# EAGLE schematic zumy_carrier_board_rev1 (EAGLE 8.2.2)
AUTHOR: A.Pullin / A.J.Chen / A.D.Buchan; REVISION: F; YEAR: 2015
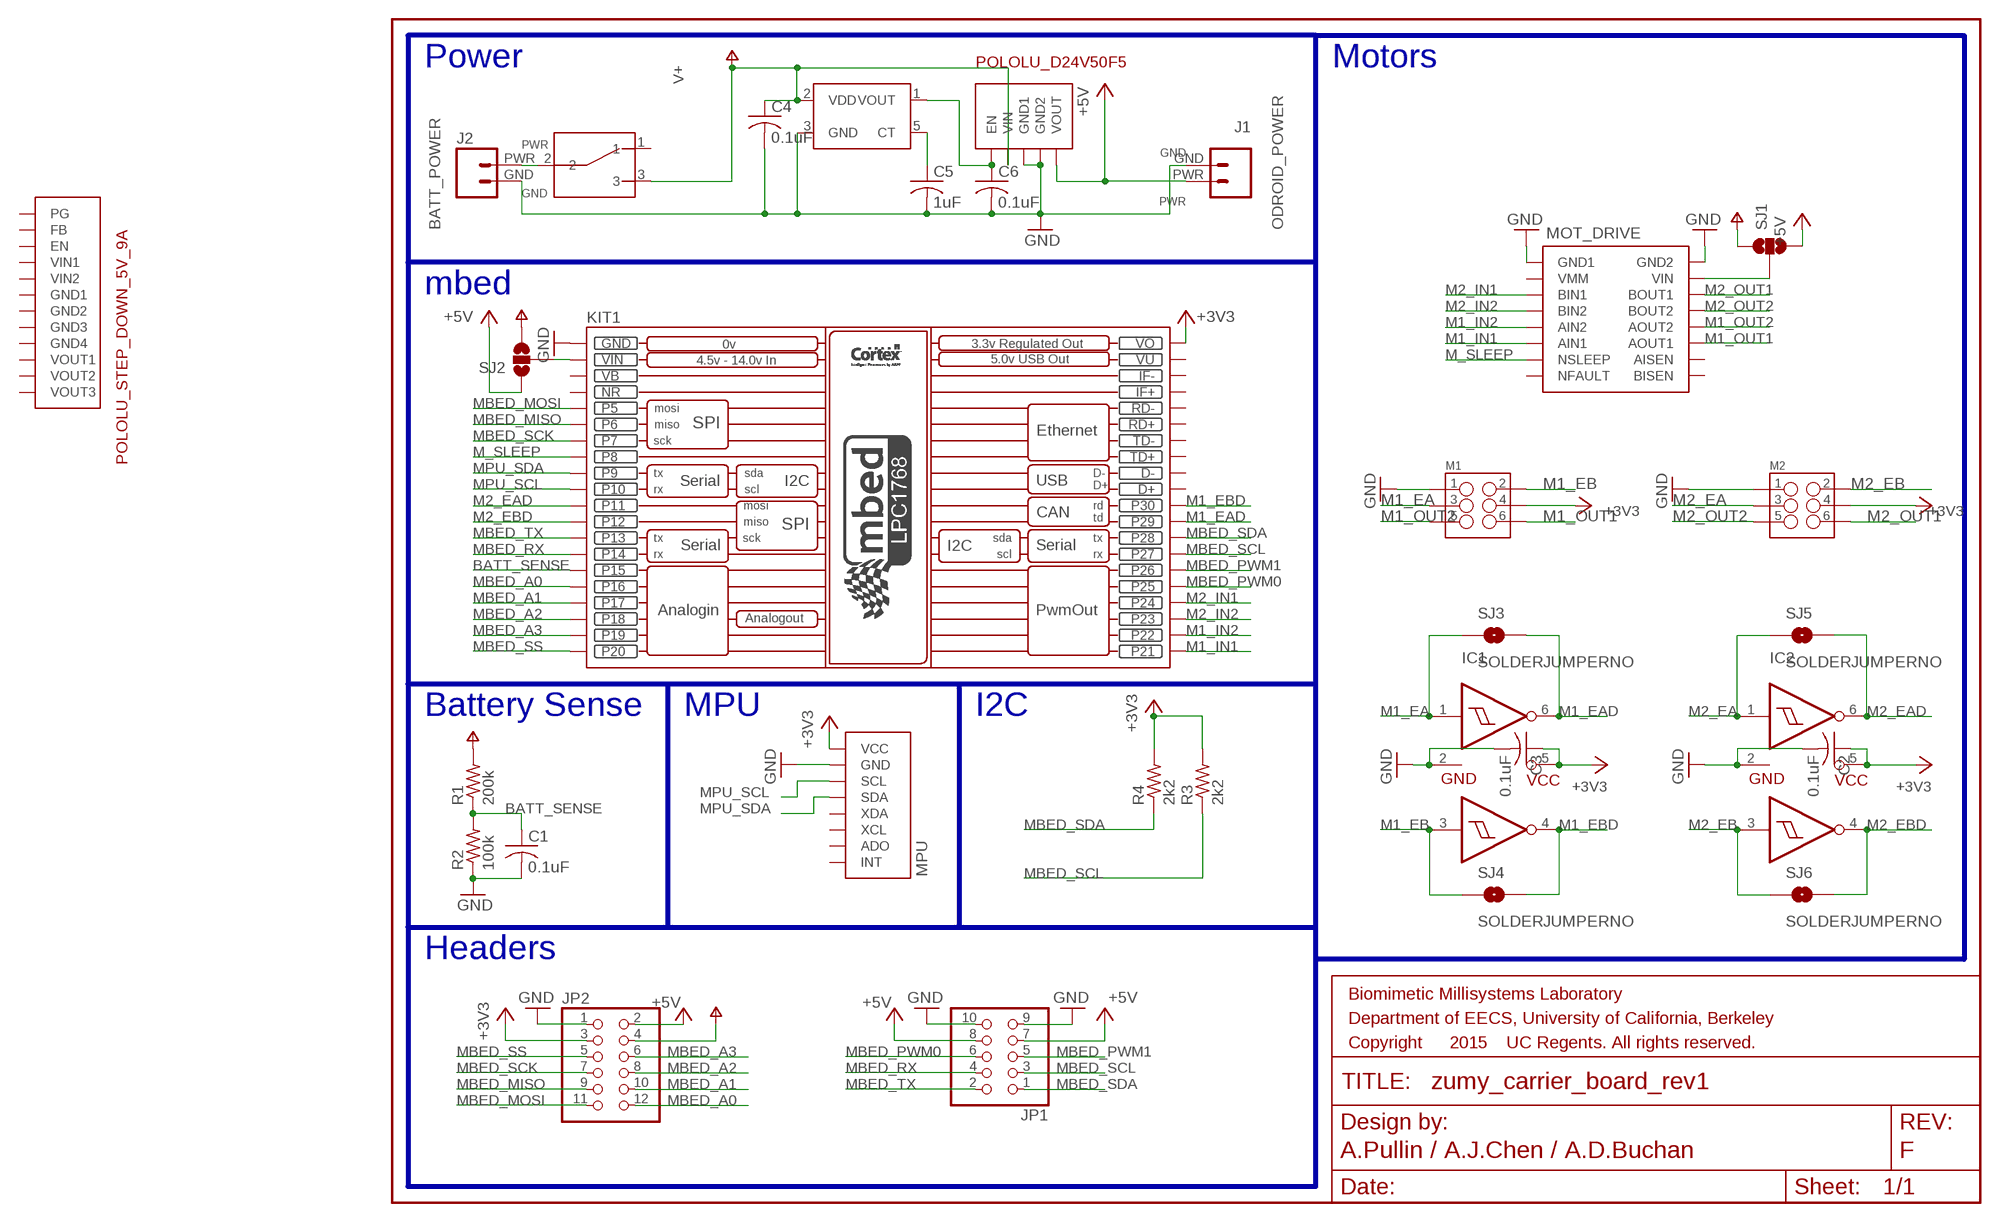
[diagram p0: schematic, sheet 1]

## Parts
C1  0.1uF  C-USC1206  [C1206]
C2  0.1uF  C-USC1206  [C1206]
C3  0.1uF  C-USC1206  [C1206]
C4  0.1uF  C-USC1206  [C1206]
C5  1uF  C-USC1206  [C1206]
C6  0.1uF  C-USC1206  [C1206]
IC1  SN74AUP2G17  [SC-70-6]
IC2  SN74AUP2G17  [SC-70-6]
J1  ODROID_POWER  [ODOIRD_PWR]
J2  BATT_POWER  [BATT_POWER]
JP1  PINHD-2X5  [2X05]
JP2  PINHD-2X6  [2X06]
KIT1  MBED_NXP_LPC1768  [MBED-KIT]
M1  M03X2SHROUD  [2X3-SHROUDED]
M2  M03X2SHROUD  [2X3-SHROUDED]
MOT_DRIVE  POLOLU_DRV8833_MODULE  [POLOLU_DRV8833_MODULE]
MPU  ITG/MPU_MODULE  [ITG/MPU_MODULE]
R1  200k  R-US_R1206  [R1206]
R2  100k  R-US_R1206  [R1206]
R3  2k2  R-US_R1206  [R1206]
R4  2k2  R-US_R1206  [R1206]
SJ1  SOLDERJUMPER_2WAYT  [SJ_2]
SJ2  SOLDERJUMPER_2WAYT  [SJ_2]
SJ3  SOLDERJUMPERNO  [SJ_2S-NO]
SJ4  SOLDERJUMPERNO  [SJ_2S-NO]
SJ5  SOLDERJUMPERNO  [SJ_2S-NO]
SJ6  SOLDERJUMPERNO  [SJ_2S-NO]
SW1  500SSP1S1M6QEA  [500SSP1S1M6QEA_SWITCH]
U$2  BD5260G  [SOT23-5]
U$3  POLOLU_STEP_DOWN_5V_9A  [POLOLU_STEP_DOWN_5V_9A]
U$5  POLOLU_D24V50F5  [POLOLU_D24V50F5]

## Nets
+3V3: C2.1 C3.1 IC1.5(VCC) IC2.5(VCC) JP2.3 KIT1.VOUT(VO) M1.4 M2.4 MPU.VCC R3.2 R4.2
+5V: J1.PWR JP1.7 JP1.8 JP2.2 SJ1.3 SJ2.1 U$5.VOUT
BATT_SENSE: C1.1 KIT1.P$15(P15) R1.1 R2.2
GND: C1.2 C2.2 C3.2 C4.2 C5.2 C6.2 IC1.2(GND) IC2.2(GND) J1.GND J2.GND JP1.9 JP1.10 JP2.1 KIT1.GND M1.1 M2.1 MOT_DRIVE.GND1 MOT_DRIVE.GND2 MPU.GND R2.1 U$2.3(GND) U$5.GND1 U$5.GND2
M1_EA: IC1.1(1A) M1.3 SJ3.1
M1_EAD: IC1.6(1Y) KIT1.P$29(P29) SJ3.2
M1_EB: IC1.3(2A) M1.2 SJ4.1
M1_EBD: IC1.4(2Y) KIT1.P$30(P30) SJ4.2
M1_IN1: KIT1.P$21(P21) MOT_DRIVE.AIN1
M1_IN2: KIT1.P$22(P22) MOT_DRIVE.AIN2
M1_OUT1: M1.6 MOT_DRIVE.AOUT1
M1_OUT2: M1.5 MOT_DRIVE.AOUT2
M2_EA: IC2.1(1A) M2.3 SJ5.1
M2_EAD: IC2.6(1Y) KIT1.P$11(P11) SJ5.2
M2_EB: IC2.3(2A) M2.2 SJ6.1
M2_EBD: IC2.4(2Y) KIT1.P$12(P12) SJ6.2
M2_IN1: KIT1.P$24(P24) MOT_DRIVE.BIN1
M2_IN2: KIT1.P$23(P23) MOT_DRIVE.BIN2
M2_OUT1: M2.6 MOT_DRIVE.BOUT1
M2_OUT2: M2.5 MOT_DRIVE.BOUT2
M_SLEEP: KIT1.P$8(P8) MOT_DRIVE.NSLEEP
MBED_A0: JP2.12 KIT1.P$16(P16)
MBED_A1: JP2.10 KIT1.P$17(P17)
MBED_A2: JP2.8 KIT1.P$18(P18)
MBED_A3: JP2.6 KIT1.P$19(P19)
MBED_MISO: JP2.9 KIT1.P$6(P6)
MBED_MOSI: JP2.11 KIT1.P$5(P5)
MBED_PWM0: JP1.6 KIT1.P$25(P25)
MBED_PWM1: JP1.5 KIT1.P$26(P26)
MBED_RX: JP1.4 KIT1.P$14(P14)
MBED_SCK: JP2.7 KIT1.P$7(P7)
MBED_SCL: JP1.3 KIT1.P$27(P27) R3.1
MBED_SDA: JP1.1 KIT1.P$28(P28) R4.1
MBED_SS: JP2.5 KIT1.P$20(P20)
MBED_TX: JP1.2 KIT1.P$13(P13)
MPU_SCL: KIT1.P$10(P10) MPU.SCL
MPU_SDA: KIT1.P$9(P9) MPU.SDA
N$1: KIT1.VIN SJ2.2
N$2: J2.PWR SW1.2
N$3: MOT_DRIVE.VIN SJ1.2
N$4: C6.1 U$2.1(VOUT) U$5.EN
N$6: C5.1 U$2.5(CT)
V+: C4.1 JP2.4 R1.2 SJ1.1 SJ2.3 SW1.3 U$2.2(VDD) U$5.VIN
Unconnected: KIT1.D+ KIT1.D- KIT1.IF+ KIT1.IF- KIT1.RD+ KIT1.RD- KIT1.TD+ KIT1.TD- MOT_DRIVE.AISEN MOT_DRIVE.BISEN MOT_DRIVE.NFAULT MOT_DRIVE.VMM MPU.ADO MPU.INT MPU.XCL MPU.XDA SW1.1 U$3.EN U$3.FB U$3.GND1 U$3.GND2 U$3.GND3 U$3.GND4 U$3.PG U$3.VIN1 U$3.VIN2 U$3.VOUT1 U$3.VOUT2 U$3.VOUT3

## Buses
B$1

## Notes on the sheet
- Power | Motors
- mbed
- Battery Sense | MPU | I2C
- Headers

## Power pins joined to a net without a drawn wire
NR: KIT1.NR
VB: KIT1.VB
VU: KIT1.VU

## Library data of the parts
C1-C6 = rcl:C-US: CAPACITOR, American symbol
IC1 IC2 = zumy:SN74AUP2G17
J1 = zumy:ODROID_POWER
J2 = zumy:BATT_POWER
JP1 = pinhead:PINHD-2X5: PIN HEADER
JP2 = pinhead:PINHD-2X6: PIN HEADER
KIT1 = zumy:MBED_NXP_LPC1768: Mbed LPC1768 - ARM CORTEX v2.1 * Schematic symbol is now placed in eagles's default raster. *The pads diameter are suitable for routing between mbed pins * mbed pads are 0.8 mm drill diameter. --------------------------------------------- Created by: Mohamed Yousry *Alexandria, Egypt *Email: mohamed.yousry@ieeegoldegypt.org
M1 M2 = SparkFun-Connectors:M03X2: 2x3 .1" header. Shrouded, with keying- CONN-10681 SMT- CONN-11415 Pogo pins- HW-11044; PROD_ID: CONN-10681
MOT_DRIVE = zumy:POLOLU_DRV8833_MODULE
MPU = zumy:ITG/MPU_MODULE
R1-R4 = resistor:R-US_: RESISTOR, American symbol
SJ1 SJ2 = SparkFun-Passives:SOLDERJUMPER_2WAY: Solder Jumper 2 way solder jumper
SJ3-SJ6 = SparkFun-Passives:SOLDERJUMPER: Solder Jumper Standard SMD solder jumper. Used to automate production. Two varients : Normally Open and Normally Closed are the same, but have different paste layers. NC will have a large amount of paste and should jumper during reflow.
SW1 = zumy:500SSP1S1M6QEA
U$2 = zumy:BD5260G
U$3 = zumy:POLOLU_STEP_DOWN_5V_9A
U$5 = zumy:POLOLU_D24V50F5